# EAGLE design irledwafer (EAGLE 8.2.1)
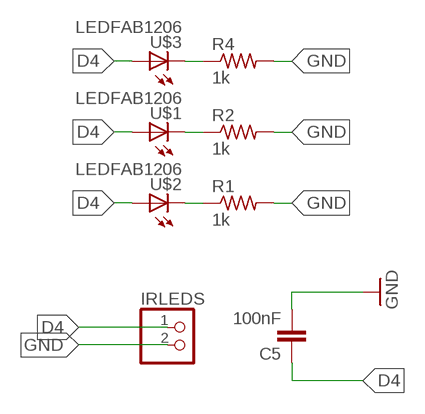
[diagram p0: schematic, sheet 1]

## Parts
C5  100nF  CAP1206  [1206]
IRLEDS  PINHD-1X2  [1X02]
R1  1k  RES-US1206FAB  [R1206FAB]
R2  1k  RES-US1206FAB  [R1206FAB]
R4  1k  RES-US1206FAB  [R1206FAB]
U$1  LEDFAB1206  [LED1206FAB]
U$2  LEDFAB1206  [LED1206FAB]
U$3  LEDFAB1206  [LED1206FAB]

## Nets
D4: C5.1 IRLEDS.1 U$1.1(A) U$2.1(A) U$3.1(A)
GND: C5.2 IRLEDS.2 R1.2 R2.2 R4.2
N$1: R1.1 U$2.2(C)
N$7: R4.1 U$3.2(C)
N$13: R2.1 U$1.2(C)

## Library data of the parts
C5 = 01_SparkFun:CAP: Capacitor Standard 0603 ceramic capacitor, and 0.1" leaded capacitor.
IRLEDS = pinhead:PINHD-1X2: PIN HEADER
R1 R2 R4 = fab:RES-US: Resistor (US Symbol) Variants with postfix FAB are widened to allow the routing of internal traces
U$1-U$3 = fab:LED: LED

## Board
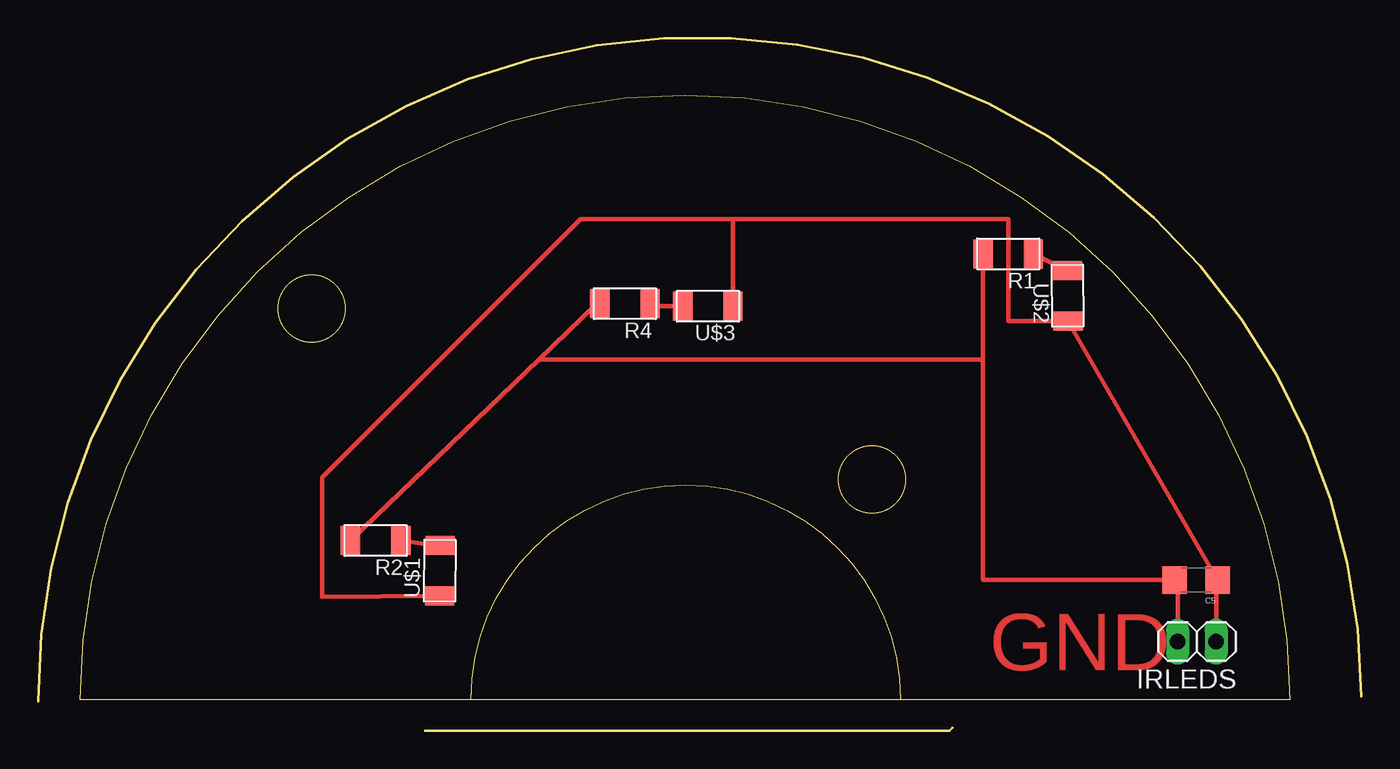
[diagram p1: board, top side]

Size 86.82 x 45.47 mm. Coordinates in mm from the lower left corner, seen from the top.
Outline: 2.76,2.05 arc-180 82.13,2.05
Outline: 82.13,2.03 2.76,2.03
Outline: 42.45,2.04 28.44,2.04 28.42,2.02 28.42,2.41
Outline: 28.4,2.05 arc-180 56.59,2.05
Outline: 25.39,0 59.79,0 60,0.2
Outline: 0,1.95 arc-180 86.82,2.26
Outline: circle at 17.94,27.72 radius 2.19
Outline: circle at 54.71,16.5 radius 2.19
Copper layers (1*16): Top 0.035mm / dielectric 1.5mm / Bottom 0.035mm
Design rules "default *": minimum track width 12mil, minimum drill 24mil, track to track 16mil, track to pad 16mil, pad to pad 16mil, via to via 16mil, smd to smd 16mil, copper to edge 40mil, drill to drill 8mil, minimum pad ring 10mil, minimum via ring 8mil, stop-mask expansion 4mil, vias tented up to drill 0mil, thermal gap 10mil

### Footprints (pad centres in the part's own frame; a part is rotated, then mirrored left to right if it is on the bottom)
1206 = smd 1.6 x 1.8: 1 -1.4,0; 2 1.4,0
1X02 = drill 1.016 long: 1 -1.27,0; 2 1.27,0
R1206FAB = smd 1.27 x 1.905: 1 -1.651,0; 2 1.651,0
LED1206FAB = smd 1.27 x 1.905: 1 -1.651,0; 2 1.651,0

### Placement (x,y rotation side)
C5  75.98,9.9 180 top
IRLEDS  76.03,5.86 180 top
R1  63.65,31.3 180 top
R2  22.14,12.49 180 top
R4  38.5,28.03 180 top
U$1  26.35,10.52 89.7 top
U$2  67.55,28.56 90.7 top
U$3  43.94,27.88 180 top

### Tracks (layer width: path | path; a pad name or v marks a point on that pad's centre or on a via)
D4
  Top 0.305: IRLEDS.1 77.3,9.82 C5.1 U$2.1 63.67,26.91 63.67,33.59 45.6,33.59 | 45.6,33.59 U$3.1 | 45.6,33.59 35.6,33.59 18.65,16.64 18.64,8.8 U$1.1
GND
  Top 0.305: IRLEDS.2 74.76,9.71 C5.2 62,9.9 62,24.39 | 37,27.39 36.85,27.54 R4.2 36.66,28.03 32.87,24.39 | 32.87,24.39 R2.2 | R1.2 62,24.39 | 62,24.39 32.87,24.39
N$1
  Top 0.305: U$2.2 R1.1
N$7
  Top 0.305: U$3.2 40.15,27.88 R4.1
N$13
  Top 0.305: R2.1 25.58,12.25 U$1.2

### Text on the board
Top: GND